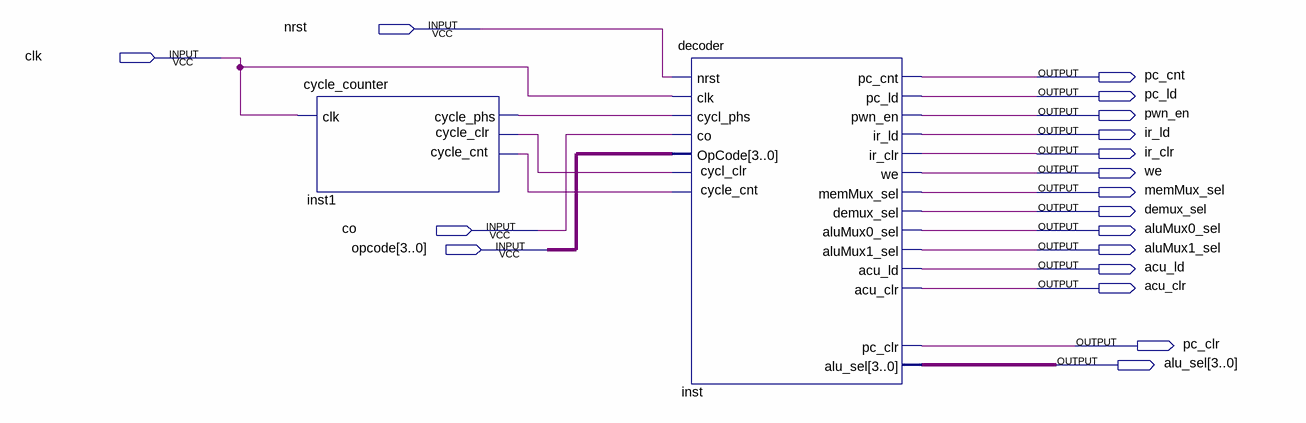
[diagram p0: schematic sheet]
// Quartus schematic CPU_Controller.bdf as structural Verilog: 2 symbols, 18 pins
module CPU_Controller (
  input  nrst,
  input  clk,
  input  co,
  input  [3:0] opcode,
  output pc_cnt,
  output pc_ld,
  output pwn_en,
  output ir_ld,
  output ir_clr,
  output we,
  output memMux_sel,
  output demux_sel,
  output aluMux0_sel,
  output aluMux1_sel,
  output acu_ld,
  output acu_clr,
  output pc_clr,
  output [3:0] alu_sel
);

  wire inst1_cycle_phs, inst_cycl_clr, inst_cycle_cnt;

  cycle_counter inst1 (.clk(clk), .cycle_clr(inst_cycl_clr), .cycle_cnt(inst_cycle_cnt), .cycle_phs(inst1_cycle_phs));
  decoder inst (
    .nrst(nrst), .clk(clk), .cycl_phs(inst1_cycle_phs), .co(co), .OpCode(opcode), .pc_cnt(pc_cnt),
    .pc_ld(pc_ld), .pwn_en(pwn_en), .ir_ld(ir_ld), .ir_clr(ir_clr), .we(we), .memMux_sel(memMux_sel),
    .demux_sel(demux_sel), .aluMux0_sel(aluMux0_sel), .aluMux1_sel(aluMux1_sel), .acu_ld(acu_ld),
    .acu_clr(acu_clr), .cycl_clr(inst_cycl_clr), .cycle_cnt(inst_cycle_cnt), .pc_clr(pc_clr),
    .alu_sel(alu_sel));
endmodule
